# EasyEDA Pro project BLDC_Driverv3.eprj, board PCB2_1
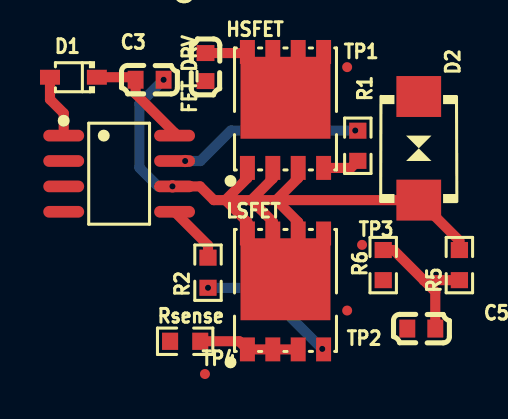
[diagram p12: board, top side]
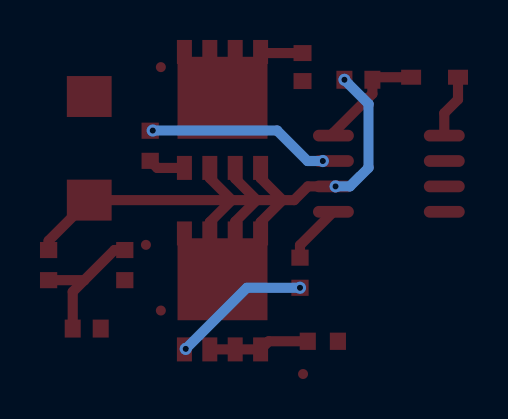
[diagram p13: board, bottom side, seen from below]

No outline. copper layers: Top Layer, Bottom Layer. Coordinates in mm from the lowest, leftmost part position.
Stack: Top Layer 0.035mm / Dielectric1 1.51mm FR4 er 4.5 / Bottom Layer 0.035mm

## Design rules (mm)
template: JLCPCB Capability(Two Layers Board)
spacing copperThickness1oz (default): track to track 0.102, other pairs 0.152 to 0.3
spacing copperThickness2oz: track to track 0.203, other pairs 0.152 to 0.3
track width copperThickness1oz (default): min 0.127, default 0.254, max 2.54
track width copperThickness2oz: min 0.203, default 0.254, max 2.54
differential pair differentialPair (default): width min 0.127, default 0.254, max 2.54; gap min 0.152, default 0.152
via viaSize (default): diameter min 0.5, default 0.61, max 10; hole min 0.3, default 0.305, max 6.3

## Placement (name value [footprint] x y rotation side)
C1  100nF  [C0603]  6.6 15.35 270 top
C3  100nF  [C0603]  3.81 14.72 0 top
C5  100nF  [C0603]  17.4 2.27 180 top
D1  1N5819WS  [SOD-323_L1.8-W1.3-LS2.5-RD]  0 14.85 180 top
D2  P6SMB6.8CA/TR13  [SMB_L4.6-W3.6-LS5.3-BI]  17.27 11.29 270 top
FET_DRV  IR2103STRPBF  [SOIC-8_L4.9-W3.9-P1.27-LS6.0-BL]  2.29 10.02 270 top
HSFET  SIR180DP-T1-RE3  [POWERPAK-SO-8_L5.9-W4.9-P1.27-LS6.2-BL]  10.61 13.21 0 top
LSFET  SIR180DP-T1-RE3  [powerpak-so-8_l5.9-w4.9-p1.27-ls6.2-bl]  10.61 4.13 0 top
R1  10  [R0603]  14.22 11.42 270 top
R2  10  [R0603]  6.73 5.07 270 top
R5  10K  [R0603]  19.3 5.45 90 top
R6  10K  [R0603]  15.49 5.45 90 top
Rsense  2mR  [R0603]  5.59 1.64 0 top
TP1  -  [Test-Point-0.5mm]  13.69 15.35 0 top
TP2  -  [Test-Point-0.5mm]  13.69 3.18 0 top
TP3  -  [Test-Point-0.5mm]  14.44 6.46 0 top
TP4  -  [Test-Point-0.5mm]  6.58 0 0 top

## Footprints (pads in the part's own frame, mm; a bottom-side part is the same pattern mirrored in y, then rotated)
C0603
  rect 0.8x0.9 smd: 1(-0.7,0) 2(0.7,0)
POWERPAK-SO-8_L5.9-W4.9-P1.27-LS6.2-BL
  rect 0.75x1.2 smd: 1(-1.905,-2.9) 2(-0.635,-2.9) 3(0.635,-2.9) 4(1.905,-2.9) 5(1.905,2.9) 6(0.635,2.9) 7(-0.635,2.9) 8(-1.905,2.9)
  rect 4.5x4.1 smd: 8(0,0.609)
powerpak-so-8_l5.9-w4.9-p1.27-ls6.2-bl
  rect 0.75x1.2 smd: 1(-1.905,-2.9) 2(-0.635,-2.9) 3(0.635,-2.9) 4(1.905,-2.9) 5(1.905,2.9) 6(0.635,2.9) 7(-0.635,2.9) 8(-1.905,2.9)
  rect 4.5x4.1 smd: 8(0,0.609)
R0603
  rect 0.806x0.864 smd: 1(-0.753,0) 2(0.753,0)
SMB_L4.6-W3.6-LS5.3-BI
  rect 2.047x2.241 smd: 1(-2.591,0) 2(2.591,0)
SOD-323_L1.8-W1.3-LS2.5-RD
  rect 1x0.75 smd: 1(-1.173,0) 2(1.173,0)
SOIC-8_L4.9-W3.9-P1.27-LS6.0-BL
  oval 0.588x2.045 smd: 1(-1.905,-2.772) 2(-0.635,-2.772) 3(0.635,-2.772) 4(1.905,-2.772) 5(1.905,2.772) 6(0.635,2.772) 7(-0.635,2.772) 8(-1.905,2.772)
Test-Point-0.5mm
  round 0.5 smd: 1(0,0)

## Nets
As in the schematic.

## Via types
v1: diameter 0.61, hole 0.305, Top Layer to Bottom Layer, 6 vias

## Routing (per net, layer and track width the routed paths; a pad name or vN(x,y) marks a point on that pad's centre or on a via; arc(x,y) is an arc through that point)
VCC: length 2.1
  Top Layer w0.508: C1.1 8.65,16.05 HSFET.8
NET4: length 7.1
  Top Layer w0.508: R6.2 16.01,6.2 17.53,4.69 ; 17.53,4.69 17.53,4.69 R5.1 ; 17.53,4.69 18.1,4.11 C5.1
PHASE_OUT: length 35.4
  Top Layer w0.508: 10.14,8.7 11.24,9.8 HSFET.3 ; 10.14,8.7 8.89,8.7 ; 10.14,8.7 11.24,7.6 LSFET.6 ; 10.14,8.7 D2.2 19.3,6.67 R5.2 ; HSFET.2 9.97,9.78 8.89,8.7 ; 7.6,8.7 7.02,8.7 6.34,9.38 FET_DRV.6 v1(4.95,9.38) ; 7.6,8.7 8.89,8.7 ; 7.6,8.7 8.7,9.8 HSFET.1 ; 7.6,8.7 8.7,7.6 LSFET.8 ; 8.89,8.7 9.97,7.62 LSFET.7
  Bottom Layer w0.508: v1(4.51,14.72) 3.3,13.51 3.3,10.32 4.23,9.38 v1(4.95,9.38)
VPA_RSP: length 5.1
  Top Layer w0.508: Rsense.2 8.29,1.64 LSFET.1 LSFET.2 LSFET.3
$1N508: length 9.3
  Top Layer w0.254: R1.1 14.22,12.18 v1(14.1,12.18)
  Bottom Layer w0.508: v1(5.59,10.66) 6.35,10.66 7.87,12.18 v1(14.1,12.18)
$1N509: length 1.9
  Top Layer w0.508: R1.2 13.87,10.31 HSFET.4
$1N510: length 3
  Top Layer w0.508: FET_DRV.5 6.73,6.44 R2.1
$1N511: length 7.1
  Top Layer w0.508: LSFET.4 12.49,1.26 v1(12.45,1.26)
  Bottom Layer w0.508: v1(12.45,1.26) 9.39,4.31 v1(6.73,4.31)
$1N519: length 3.2
  Top Layer w0.508: D1.2 -1.17,13.73 -0.49,13.05 FET_DRV.1
$1N521: length 5.6
  Top Layer w0.508: FET_DRV.8 5.06,12.07 3.11,14.01 C3.1 2.98,14.85 D1.1
